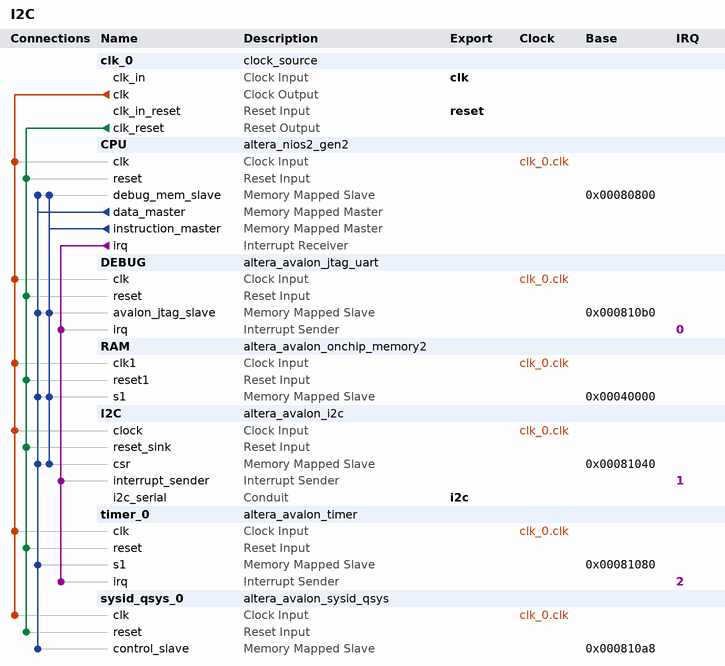
[diagram p0: system contents]
# Platform Designer (Qsys) system I2C, Cyclone IV E EP4CE115F29C7
# Parameters at their usual value, and those the tool derives, are not listed.
package require -exact qsys 17.1
create_system I2C
set_project_property DEVICE_FAMILY {Cyclone IV E}
set_project_property DEVICE EP4CE115F29C7

add_instance clk_0 clock_source 17.1
set_instance_parameter_value clk_0 clockFrequency 50000000

add_instance CPU altera_nios2_gen2 17.1
set_instance_parameter_value CPU dcache_size 2048
set_instance_parameter_value CPU exceptionSlave RAM.s1
set_instance_parameter_value CPU icache_size 4096
set_instance_parameter_value CPU impl Tiny
set_instance_parameter_value CPU resetSlave RAM.s1

add_instance DEBUG altera_avalon_jtag_uart 17.1
set_instance_parameter_value DEBUG simInteractiveOptions NO_INTERACTIVE_WINDOWS

add_instance RAM altera_avalon_onchip_memory2 17.1
set_instance_parameter_value RAM dataWidth 32
set_instance_parameter_value RAM dualPort false
set_instance_parameter_value RAM initMemContent true
set_instance_parameter_value RAM initializationFileName onchip_mem.hex
set_instance_parameter_value RAM memorySize 204800

add_instance I2C altera_avalon_i2c 17.1
set_instance_parameter_value I2C FIFO_DEPTH 4

add_instance timer_0 altera_avalon_timer 17.1
set_instance_parameter_value timer_0 period 1
set_instance_parameter_value timer_0 periodUnits MSEC

add_instance sysid_qsys_0 altera_avalon_sysid_qsys 17.1
set_instance_parameter_value sysid_qsys_0 id 0

# connections
add_connection clk_0.clk CPU.clk clock
add_connection clk_0.clk DEBUG.clk clock
add_connection clk_0.clk I2C.clock clock
add_connection clk_0.clk RAM.clk1 clock
add_connection clk_0.clk sysid_qsys_0.clk clock
add_connection clk_0.clk timer_0.clk clock
add_connection clk_0.clk_reset CPU.reset reset
add_connection clk_0.clk_reset DEBUG.reset reset
add_connection clk_0.clk_reset I2C.reset_sink reset
add_connection clk_0.clk_reset RAM.reset1 reset
add_connection clk_0.clk_reset sysid_qsys_0.reset reset
add_connection clk_0.clk_reset timer_0.reset reset
add_connection CPU.data_master CPU.debug_mem_slave avalon
set_connection_parameter_value CPU.data_master/CPU.debug_mem_slave baseAddress 0x00080800
add_connection CPU.data_master DEBUG.avalon_jtag_slave avalon
set_connection_parameter_value CPU.data_master/DEBUG.avalon_jtag_slave baseAddress 0x000810b0
add_connection CPU.data_master I2C.csr avalon
set_connection_parameter_value CPU.data_master/I2C.csr baseAddress 0x00081040
add_connection CPU.data_master RAM.s1 avalon
set_connection_parameter_value CPU.data_master/RAM.s1 baseAddress 0x00040000
add_connection CPU.data_master sysid_qsys_0.control_slave avalon
set_connection_parameter_value CPU.data_master/sysid_qsys_0.control_slave baseAddress 0x000810a8
add_connection CPU.data_master timer_0.s1 avalon
set_connection_parameter_value CPU.data_master/timer_0.s1 baseAddress 0x00081080
add_connection CPU.instruction_master CPU.debug_mem_slave avalon
set_connection_parameter_value CPU.instruction_master/CPU.debug_mem_slave baseAddress 0x00080800
add_connection CPU.instruction_master DEBUG.avalon_jtag_slave avalon
set_connection_parameter_value CPU.instruction_master/DEBUG.avalon_jtag_slave baseAddress 0x000810b0
add_connection CPU.instruction_master I2C.csr avalon
set_connection_parameter_value CPU.instruction_master/I2C.csr baseAddress 0x00081040
add_connection CPU.instruction_master RAM.s1 avalon
set_connection_parameter_value CPU.instruction_master/RAM.s1 baseAddress 0x00040000
add_connection CPU.irq DEBUG.irq interrupt
set_connection_parameter_value CPU.irq/DEBUG.irq irqNumber 0
add_connection CPU.irq I2C.interrupt_sender interrupt
set_connection_parameter_value CPU.irq/I2C.interrupt_sender irqNumber 1
add_connection CPU.irq timer_0.irq interrupt
set_connection_parameter_value CPU.irq/timer_0.irq irqNumber 2

# exported interfaces
add_interface clk clock sink
set_interface_property clk EXPORT_OF clk_0.clk_in
add_interface i2c conduit end
set_interface_property i2c EXPORT_OF I2C.i2c_serial
add_interface reset reset sink
set_interface_property reset EXPORT_OF clk_0.clk_in_reset

set_interconnect_requirement {$system} qsys_mm.clockCrossingAdapter HANDSHAKE
set_interconnect_requirement {$system} qsys_mm.enableEccProtection FALSE
set_interconnect_requirement {$system} qsys_mm.insertDefaultSlave FALSE
set_interconnect_requirement {$system} qsys_mm.maxAdditionalLatency 1

save_system I2C.qsys
